# EAGLE schematic Indev 3 (EAGLE 6.3)
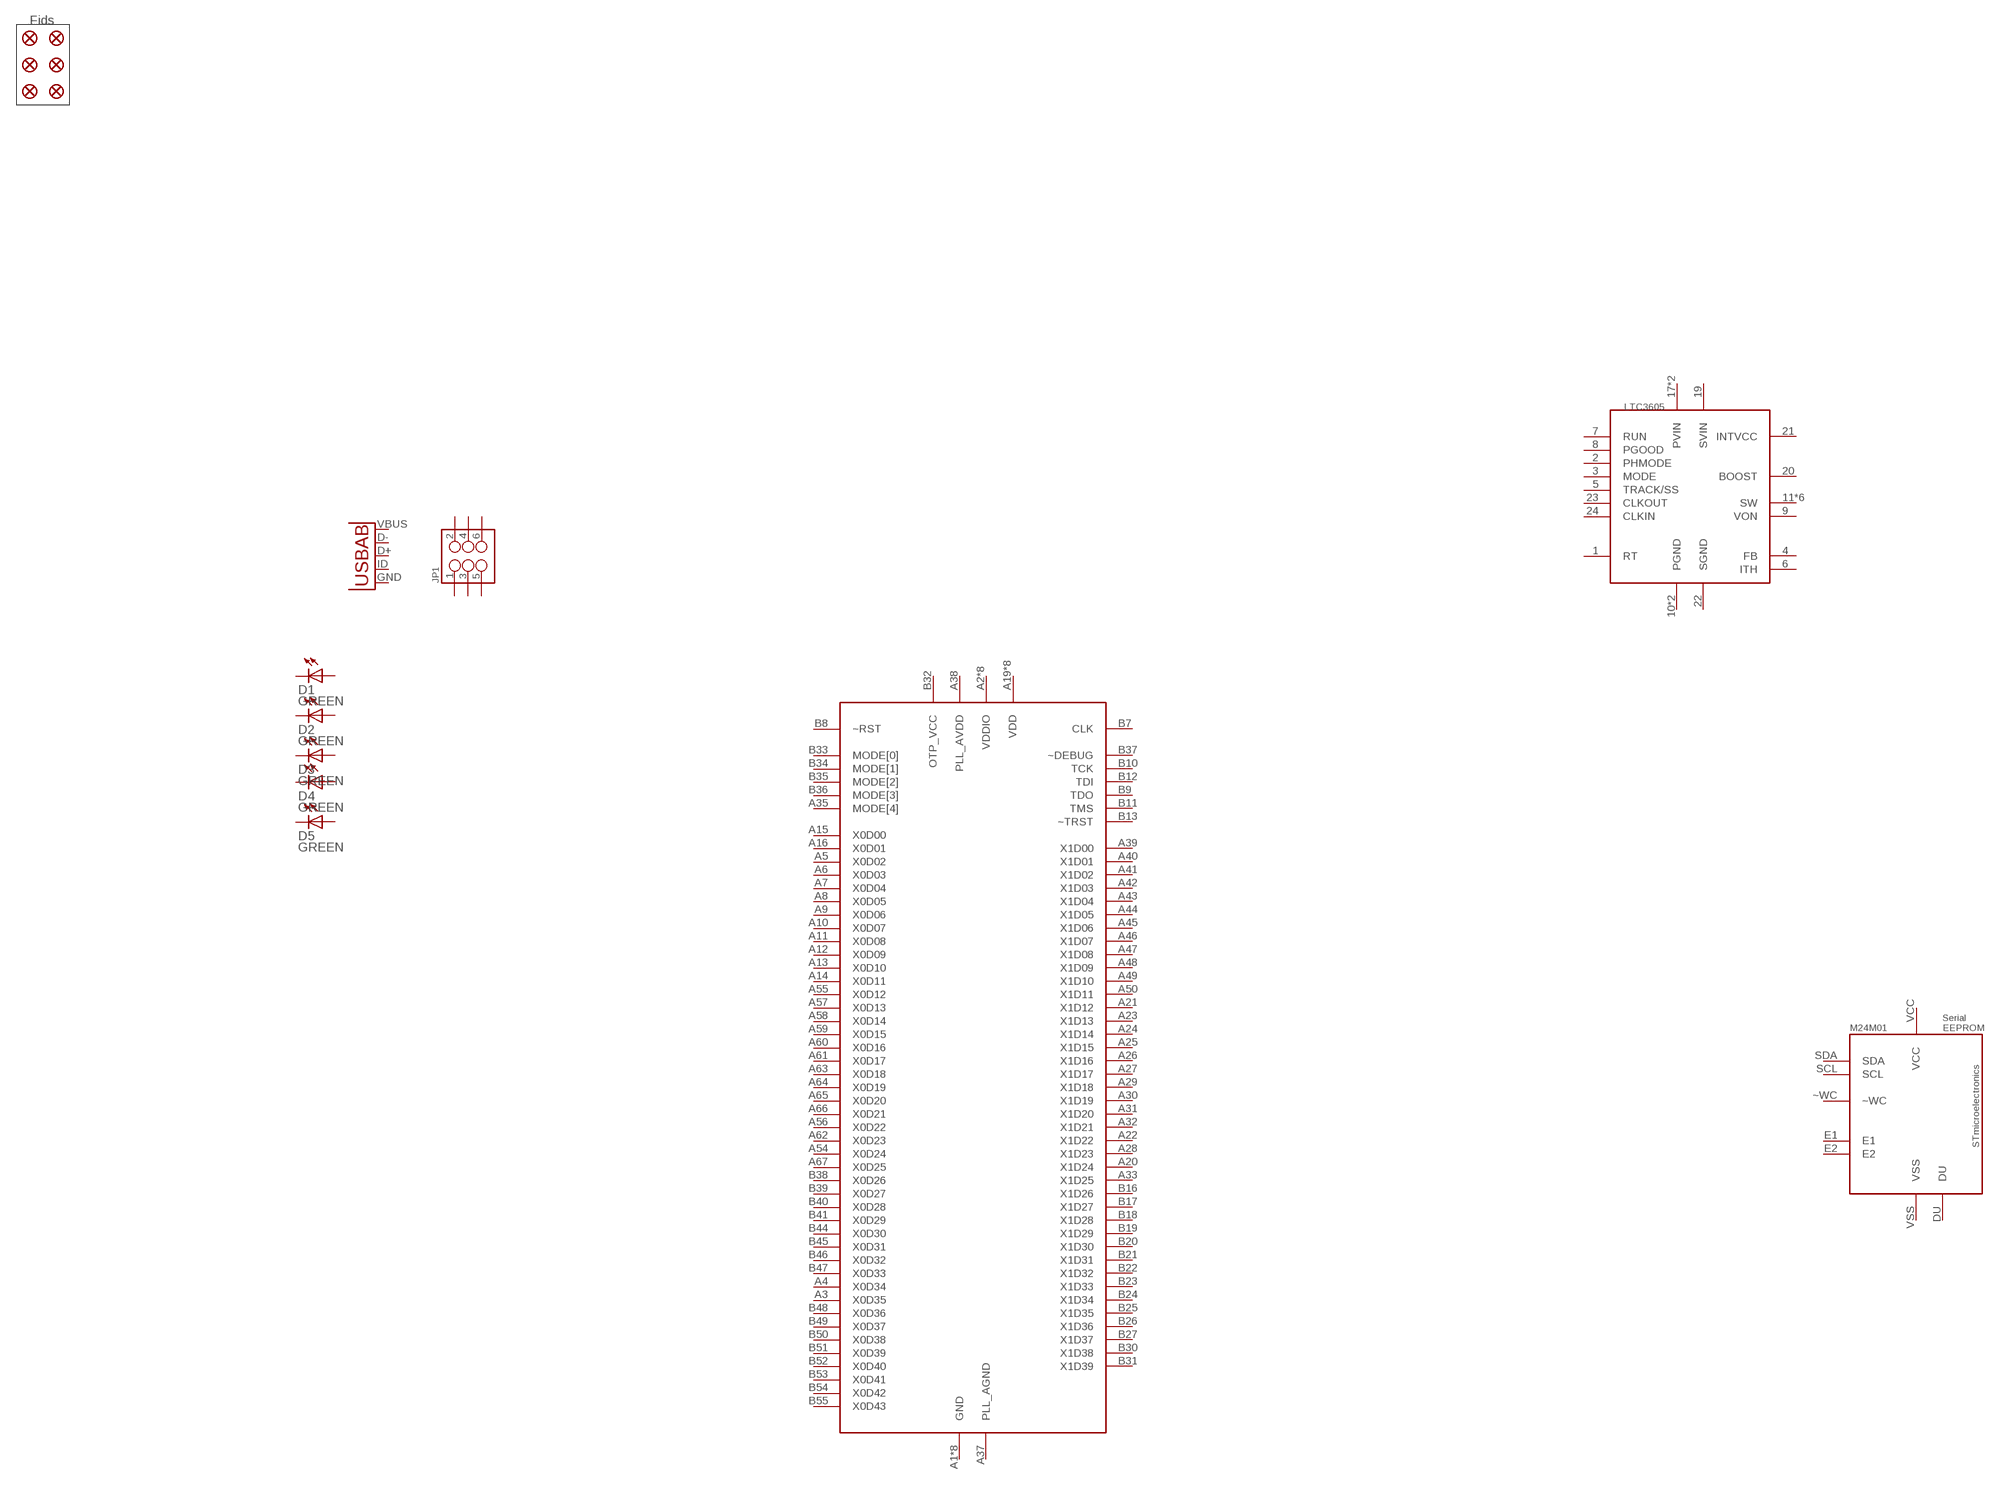
[diagram p0: schematic, sheet 1, part 1 of 2]
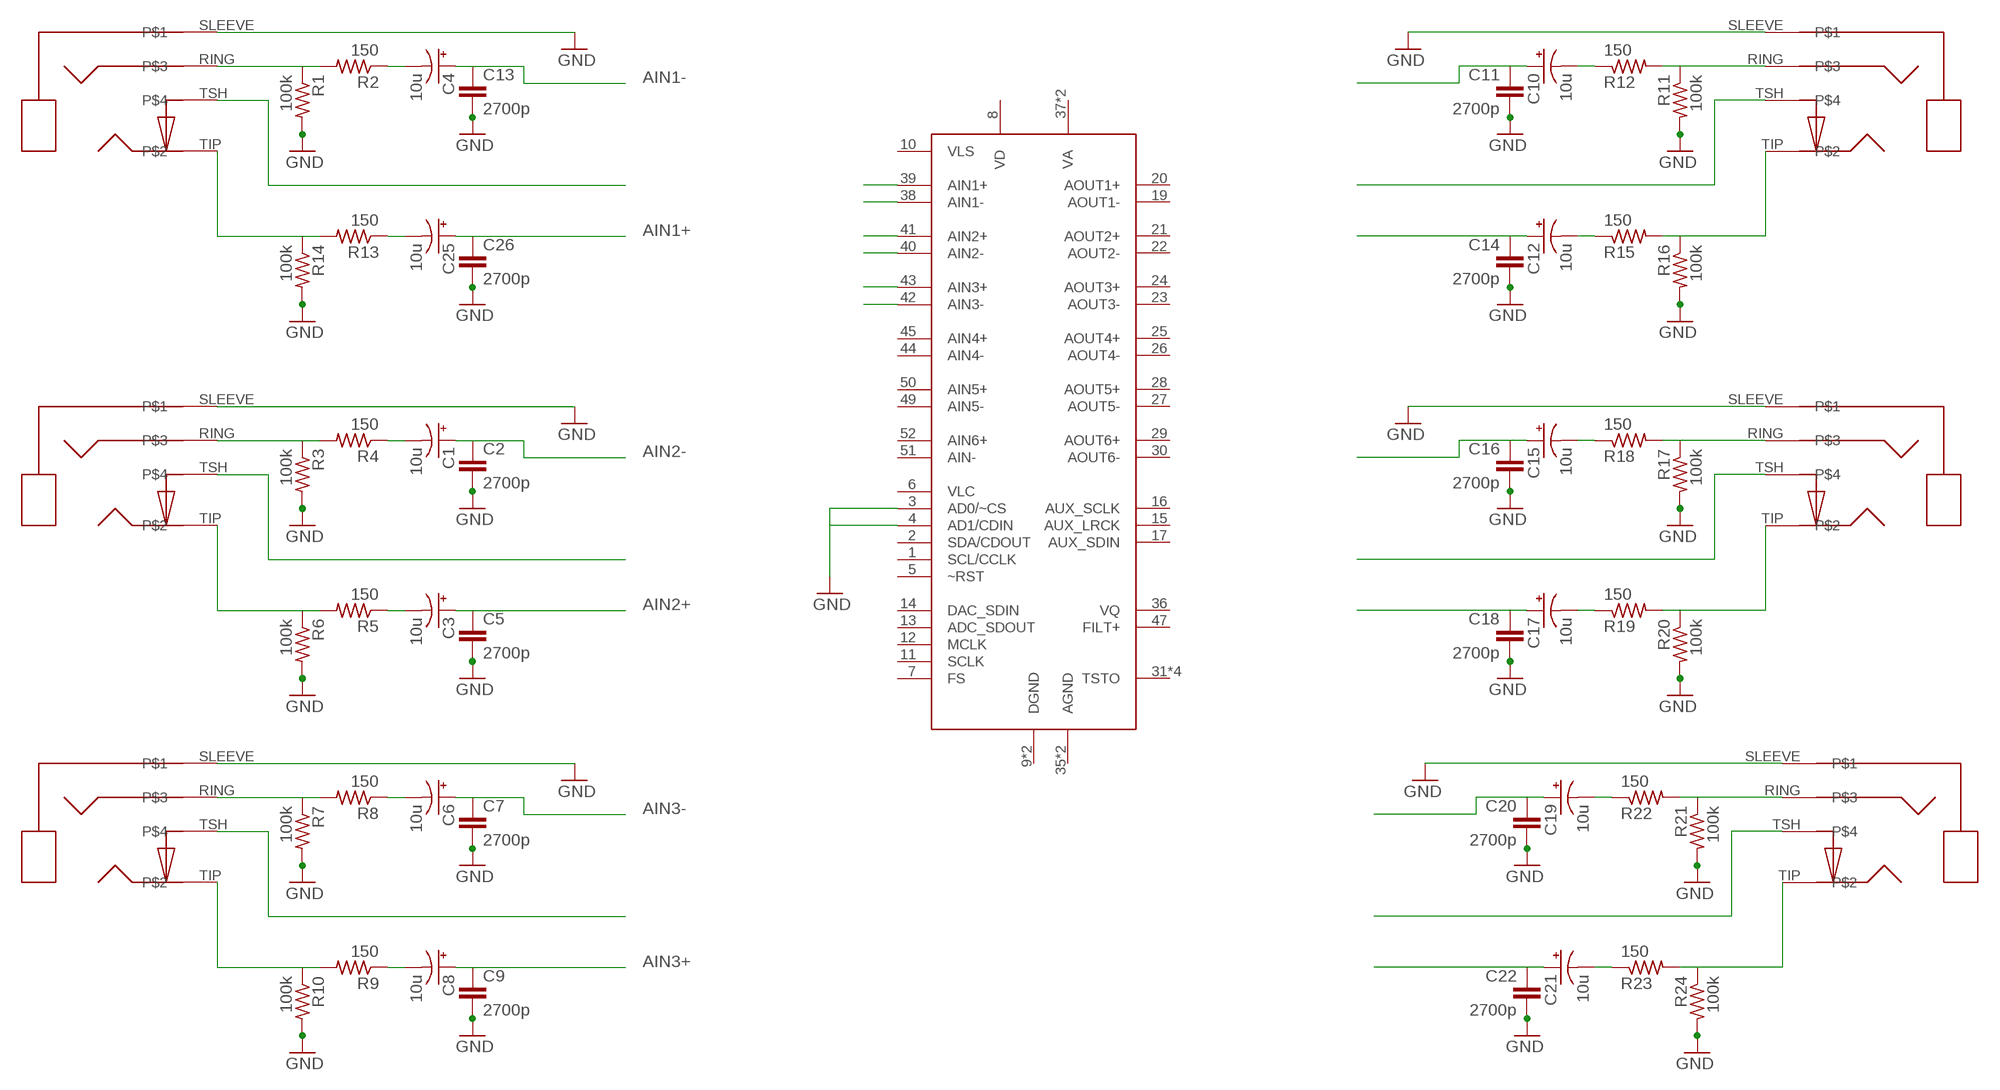
[diagram p1: schematic, sheet 1, part 2 of 2]

## Parts
C1  10u  CPOL-USB  [PANASONIC_B]
C2  2700p  CAP0603-CAP  [0603-CAP]
C3  10u  CPOL-USB  [PANASONIC_B]
C4  10u  CPOL-USB  [PANASONIC_B]
C5  2700p  CAP0603-CAP  [0603-CAP]
C6  10u  CPOL-USB  [PANASONIC_B]
C7  2700p  CAP0603-CAP  [0603-CAP]
C8  10u  CPOL-USB  [PANASONIC_B]
C9  2700p  CAP0603-CAP  [0603-CAP]
C10  10u  CPOL-USB  [PANASONIC_B]
C11  2700p  CAP0603-CAP  [0603-CAP]
C12  10u  CPOL-USB  [PANASONIC_B]
C13  2700p  CAP0603-CAP  [0603-CAP]
C14  2700p  CAP0603-CAP  [0603-CAP]
C15  10u  CPOL-USB  [PANASONIC_B]
C16  2700p  CAP0603-CAP  [0603-CAP]
C17  10u  CPOL-USB  [PANASONIC_B]
C18  2700p  CAP0603-CAP  [0603-CAP]
C19  10u  CPOL-USB  [PANASONIC_B]
C20  2700p  CAP0603-CAP  [0603-CAP]
C21  10u  CPOL-USB  [PANASONIC_B]
C22  2700p  CAP0603-CAP  [0603-CAP]
C25  10u  CPOL-USB  [PANASONIC_B]
C26  2700p  CAP0603-CAP  [0603-CAP]
D1  GREEN  LED-GREEN0603  [LED-0603]
D2  GREEN  LED-GREEN0603  [LED-0603]
D3  GREEN  LED-GREEN0603  [LED-0603]
D4  GREEN  LED-GREEN0603  [LED-0603]
D5  GREEN  LED-GREEN0603  [LED-0603]
J1  SJ3524_AUDIO  [SJ3524_AUDIO]
J2  SJ3524_AUDIO  [SJ3524_AUDIO]
J3  SJ3524_AUDIO  [SJ3524_AUDIO]
J4  SJ3524_AUDIO  [SJ3524_AUDIO]
J5  SJ3524_AUDIO  [SJ3524_AUDIO]
J6  SJ3524_AUDIO  [SJ3524_AUDIO]
JP1  M03X2SMT  [2X3_SMT_POSTS]
JP2  FIDUCIAL1X2  [FIDUCIAL-1X2]
JP3  FIDUCIAL1X2  [FIDUCIAL-1X2]
JP4  FIDUCIAL1X2  [FIDUCIAL-1X2]
JP5  FIDUCIAL1X2  [FIDUCIAL-1X2]
JP6  FIDUCIAL1X2  [FIDUCIAL-1X2]
JP7  FIDUCIAL1X2  [FIDUCIAL-1X2]
R1  100k  R-US_R0402  [R0402]
R2  150  R-US_R0402  [R0402]
R3  100k  R-US_R0402  [R0402]
R4  150  R-US_R0402  [R0402]
R5  150  R-US_R0402  [R0402]
R6  100k  R-US_R0402  [R0402]
R7  100k  R-US_R0402  [R0402]
R8  150  R-US_R0402  [R0402]
R9  150  R-US_R0402  [R0402]
R10  100k  R-US_R0402  [R0402]
R11  100k  R-US_R0402  [R0402]
R12  150  R-US_R0402  [R0402]
R13  150  R-US_R0402  [R0402]
R14  100k  R-US_R0402  [R0402]
R15  150  R-US_R0402  [R0402]
R16  100k  R-US_R0402  [R0402]
R17  100k  R-US_R0402  [R0402]
R18  150  R-US_R0402  [R0402]
R19  150  R-US_R0402  [R0402]
R20  100k  R-US_R0402  [R0402]
R21  100k  R-US_R0402  [R0402]
R22  150  R-US_R0402  [R0402]
R23  150  R-US_R0402  [R0402]
R24  100k  R-US_R0402  [R0402]
U1  USB-AB  [USB-AB-MICRO-SMD]
U$1  XS1-L8A-128-QF124  [QFN-124]
U$2  LTC3605  [QFN24]
U$3  CS42436  [QFP-52]
U$6  M24M01  [M24M01]

## Nets
AIN1+: C25.+ C26.1 U$3.39(AIN1+)
AIN1-: C4.+ C13.1 U$3.38(AIN1-)
AIN2+: C3.+ C5.1 U$3.41(AIN2+)
AIN2-: C1.+ C2.1 U$3.40(AIN2-)
AIN3+: C8.+ C9.1 U$3.43(AIN3+)
AIN3-: C6.+ C7.1 U$3.42(AIN3-)
GND: C2.2 C5.2 C7.2 C9.2 C11.2 C13.2 C14.2 C16.2 C18.2 C20.2 C22.2 C26.2 J1.SLEEVE J2.SLEEVE J3.SLEEVE J4.SLEEVE J5.SLEEVE J6.SLEEVE R1.2 R3.2 R6.2 R7.2 R10.2 R11.2 R14.2 R16.2 R17.2 R20.2 R21.2 R24.2 U$3.3(AD0/~CS) U$3.4(AD1/CDIN)
N$1: J1.TIP R13.2 R14.1
N$2: J1.RING R1.1 R2.2
N$3: C4.- R2.1
N$5: C25.- R13.1
N$7: J1.TSH
N$8: J2.RING R3.1 R4.2
N$9: C1.- R4.1
N$11: J2.TIP R5.2 R6.1
N$12: C3.- R5.1
N$14: J2.TSH
N$15: J3.RING R7.1 R8.2
N$16: C6.- R8.1
N$18: J3.TIP R9.2 R10.1
N$19: C8.- R9.1
N$21: J3.TSH
N$22: J4.RING R11.1 R12.2
N$23: C10.- R12.1
N$24: C10.+ C11.1
N$25: J4.TIP R15.2 R16.1
N$26: C12.- R15.1
N$27: C12.+ C14.1
N$28: J4.TSH
N$29: J5.RING R17.1 R18.2
N$30: C15.- R18.1
N$31: C15.+ C16.1
N$32: J5.TIP R19.2 R20.1
N$33: C17.- R19.1
N$34: C17.+ C18.1
N$35: J5.TSH
N$36: J6.RING R21.1 R22.2
N$37: C19.- R22.1
N$38: C19.+ C20.1
N$39: J6.TIP R23.2 R24.1
N$40: C21.- R23.1
N$41: C21.+ C22.1
N$42: J6.TSH
Unconnected: D1.A D1.C D2.A D2.C D3.A D3.C D4.A D4.C D5.A D5.C JP1.1 JP1.2 JP1.3 JP1.4 JP1.5 JP1.6 U1.D+ U1.D- U1.GND U1.ID(USBID) U1.VBUS U$1.A1(GND) U$1.A2(VDDIO) U$1.A3(X0D35) U$1.A4(X0D34) U$1.A5(X0D02) U$1.A6(X0D03) U$1.A7(X0D04) U$1.A8(X0D05) U$1.A9(X0D06) U$1.A10(X0D07) U$1.A11(X0D08) U$1.A12(X0D09) U$1.A13(X0D10) U$1.A14(X0D11) U$1.A15(X0D00) U$1.A16(X0D01) U$1.A17(VDDIO) U$1.A18(GND) U$1.A19(VDD) U$1.A20(X1D24) U$1.A21(X1D12) U$1.A22(X1D22) U$1.A23(X1D13) U$1.A24(X1D14) U$1.A25(X1D15) U$1.A26(X1D16) U$1.A27(X1D17) U$1.A28(X1D23) U$1.A29(X1D18) U$1.A30(X1D19) U$1.A31(X1D20) U$1.A32(X1D21) U$1.A33(X1D25) U$1.A34(VDD) U$1.A35(MODE[4]) U$1.A36(VDDIO) U$1.A37(PLL_AGND) U$1.A38(PLL_AVDD) U$1.A39(X1D00) U$1.A40(X1D01) U$1.A41(X1D02) U$1.A42(X1D03) U$1.A43(X1D04) U$1.A44(X1D05) U$1.A45(X1D06) U$1.A46(X1D07) U$1.A47(X1D08) U$1.A48(X1D09) U$1.A49(X1D10) U$1.A50(X1D11) U$1.A51(VDDIO) U$1.A52(GND) U$1.A53(VDD) U$1.A54(X0D24) U$1.A55(X0D12) U$1.A56(X0D22) U$1.A57(X0D13) U$1.A58(X0D14) U$1.A59(X0D15) U$1.A60(X0D16) U$1.A61(X0D17) U$1.A62(X0D23) U$1.A63(X0D18) U$1.A64(X0D19) U$1.A65(X0D20) U$1.A66(X0D21) U$1.A67(X0D25) U$1.A68(VDD) U$1.B1(VDDIO) U$1.B2(GND) U$1.B4(GND) U$1.B5(GND) U$1.B6(GND) U$1.B7(CLK) U$1.B8(~RST) U$1.B9(TDO) U$1.B10(TCK) U$1.B11(TMS) U$1.B12(TDI) U$1.B13(~TRST) U$1.B14(VDDIO) U$1.B15(VDD) U$1.B16(X1D26) U$1.B17(X1D27) U$1.B18(X1D28) U$1.B19(X1D29) U$1.B20(X1D30) U$1.B21(X1D31) U$1.B22(X1D32) U$1.B23(X1D33) U$1.B24(X1D34) U$1.B25(X1D35) U$1.B26(X1D36) U$1.B27(X1D37) U$1.B28(VDD) U$1.B29(VDDIO) U$1.B30(X1D38) U$1.B31(X1D39) U$1.B32(OTP_VCC) U$1.B33(MODE[0]) U$1.B34(MODE[1]) U$1.B35(MODE[2]) U$1.B36(MODE[3]) U$1.B37(~DEBUG) U$1.B38(X0D26) U$1.B39(X0D27) U$1.B40(X0D28) U$1.B41(X0D29) U$1.B42(VDDIO) U$1.B43(VDD) U$1.B44(X0D30) U$1.B45(X0D31) U$1.B46(X0D32) U$1.B47(X0D33) U$1.B48(X0D36) U$1.B49(X0D37) U$1.B50(X0D38) U$1.B51(X0D39) U$1.B52(X0D40) U$1.B53(X0D41) U$1.B54(X0D42) U$1.B55(X0D43) U$1.B56(VDD) U$1.PAD(GND) U$2.1(RT) U$2.2(PHMODE) U$2.3(MODE) U$2.4(FB) U$2.5(TRACK/SS) U$2.6(ITH) U$2.7(RUN) U$2.8(PGOOD) U$2.9(VON) U$2.10(PGND) U$2.11(SW) U$2.12(SW) U$2.13(SW) U$2.14(SW) U$2.15(SW) U$2.16(SW) U$2.17(PVIN) U$2.18(PVIN) U$2.19(SVIN) U$2.20(BOOST) U$2.21(INTVCC) U$2.22(SGND) U$2.23(CLKOUT) U$2.24(CLKIN) U$2.EXP(PGND) U$3.1(SCL/CCLK) U$3.2(SDA/CDOUT) U$3.5(~RST) U$3.6(VLC) U$3.7(FS) U$3.8(VD) U$3.9(DGND) U$3.10(VLS) U$3.11(SCLK) U$3.12(MCLK) U$3.13(ADC_SDOUT) U$3.14(DAC_SDIN) U$3.15(AUX_LRCK) U$3.16(AUX_SCLK) U$3.17(AUX_SDIN) U$3.18(DGND) U$3.19(AOUT1-) U$3.20(AOUT1+) U$3.21(AOUT2+) U$3.22(AOUT2-) U$3.23(AOUT3-) U$3.24(AOUT3+) U$3.25(AOUT4+) U$3.26(AOUT4-) U$3.27(AOUT5-) U$3.28(AOUT5+) U$3.29(AOUT6+) U$3.30(AOUT6-) U$3.31(TSTO) U$3.32(TSTO) U$3.33(TSTO) U$3.34(TSTO) U$3.35(AGND) U$3.36(VQ) U$3.37(VA) U$3.44(AIN4-) U$3.45(AIN4+) U$3.46(VA) U$3.47(FILT+) U$3.48(AGND) U$3.49(AIN5-) U$3.50(AIN5+) U$3.51(AIN-) U$3.52(AIN6+) U$6.DU U$6.E1 U$6.E2 U$6.SCL U$6.SDA U$6.VCC U$6.VSS U$6.~WC

## Notes on the sheet
- Fids

## Library data of the parts
C1 C3 C4 C6 C8 C10 C12 C15 C17 C19 C21 C25 = adafruit:CPOL-US: POLARIZED CAPACITOR, American symbol
C2 C5 C7 C9 C11 C13 C14 C16 C18 C20 C22 C26 = 1x05smd:CAP: Capacitor Standard 0603 ceramic capacitor, and 0.1" leaded capacitor.
D1-D5 = SparkFun-LED:LED-GREEN: Various green LEDs 0603- DIO-00821 LARGE- DIO-00862 LILYPAD- DIO-09910; PROD_ID: DIO-00821
J1-J6 = Strutz Electronic Industries:SJ3524_AUDIO
JP1 = SparkFun-Connectors:M03X2: 2x3 .1" header. Shrouded, with keying- CONN-10681 SMT- CONN-11415 Pogo pins- HW-11044; PROD_ID: CONN-11415
JP2-JP7 = SparkFun:FIDUCIAL: Fiducial Alignment Points Various fiducial points for machine vision alignment.
R1-R24 = adafruit:R-US_: RESISTOR, American symbol
U1 = SparkFun-Connectors:USB-AB: This is a USB AB connector that is compatible with USB OTG. i.e. this connector can serve as a host or device
U$1 = Strutz Electronic Industries:XS1-L8A-128-QF124
U$2 = Strutz Electronic Industries:LTC3605
U$3 = Strutz Electronic Industries:CS42436
U$6 = Strutz Electronic Industries:M24M01